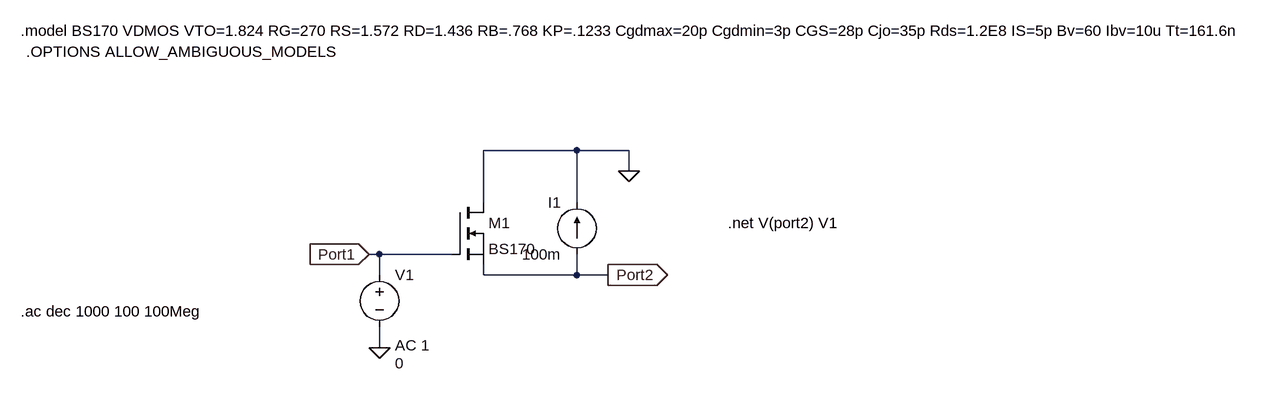
[diagram p0: schematic CircuitoBS170.asc]
CircuitoBS170.asc, the LTspice schematic file:
Version 4.1
SHEET 1 2096 680
WIRE 384 -16 240 -16
WIRE 464 -16 384 -16
WIRE 464 16 464 -16
WIRE 240 64 240 -16
WIRE 384 64 384 -16
WIRE 80 144 64 144
WIRE 192 144 80 144
WIRE 80 176 80 144
WIRE 240 176 240 160
WIRE 384 176 384 144
WIRE 384 176 240 176
WIRE 432 176 384 176
WIRE 80 288 80 256
FLAG 64 144 Port1
IOPIN 64 144 In
FLAG 432 176 Port2
IOPIN 432 176 Out
FLAG 80 288 0
FLAG 464 16 0
SYMBOL nmos 192 64 R0
SYMATTR InstName M1
SYMATTR Value BS170
SYMBOL voltage 80 160 R0
WINDOW 3 24 152 Left 2
WINDOW 123 24 124 Left 2
WINDOW 39 0 0 Left 0
SYMATTR Value 0
SYMATTR Value2 AC 1
SYMATTR InstName V1
SYMBOL current 384 144 R180
WINDOW 0 24 80 Left 2
WINDOW 3 24 0 Left 2
WINDOW 123 0 0 Left 0
WINDOW 39 0 0 Left 0
SYMATTR InstName I1
SYMATTR Value 100m
TEXT -472 -200 Left 2 !.model BS170 VDMOS VTO=1.824 RG=270 RS=1.572 RD=1.436 RB=.768 KP=.1233 Cgdmax=20p Cgdmin=3p CGS=28p Cjo=35p Rds=1.2E8 IS=5p Bv=60 Ibv=10u Tt=161.6n
TEXT 616 96 Left 2 !.net V(port2) V1
TEXT -472 232 Left 2 !.ac dec 1000 100 100Meg
TEXT -464 -168 Left 2 !.OPTIONS ALLOW_AMBIGUOUS_MODELS

The netlist it stands for:
* CircuitoBS170.asc
M1 0 Port1 Port2 Port2 BS170
V1 Port1 0 0 AC 1
I1 Port2 0 100m
.model NMOS NMOS
.model PMOS PMOS
.lib standard.mos
.model BS170 VDMOS VTO=1.824 RG=270 RS=1.572 RD=1.436 RB=.768 KP=.1233 Cgdmax=20p Cgdmin=3p CGS=28p Cjo=35p Rds=1.2E8 IS=5p Bv=60 Ibv=10u Tt=161.6n
.net V(port2) V1
.ac dec 1000 100 100Meg
.OPTIONS ALLOW_AMBIGUOUS_MODELS
.backanno
.end